# EasyEDA Pro project ProPrj_PCB_2025-05-19.epro, board 手掌0.3
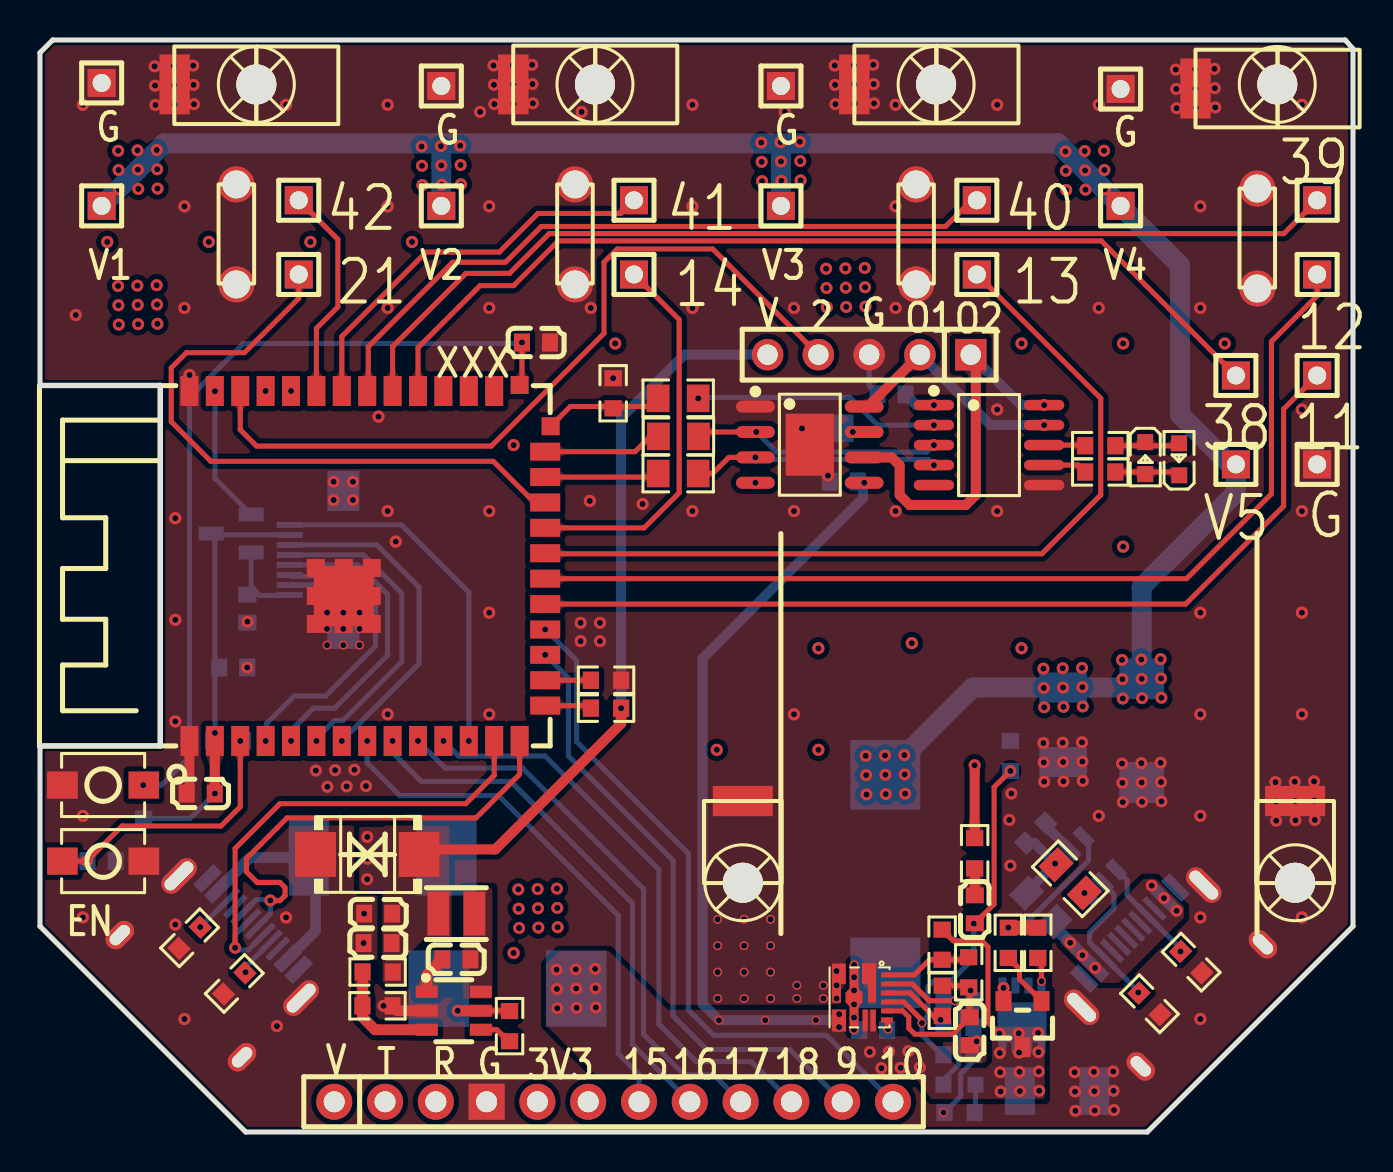
[diagram p8: board, top side]
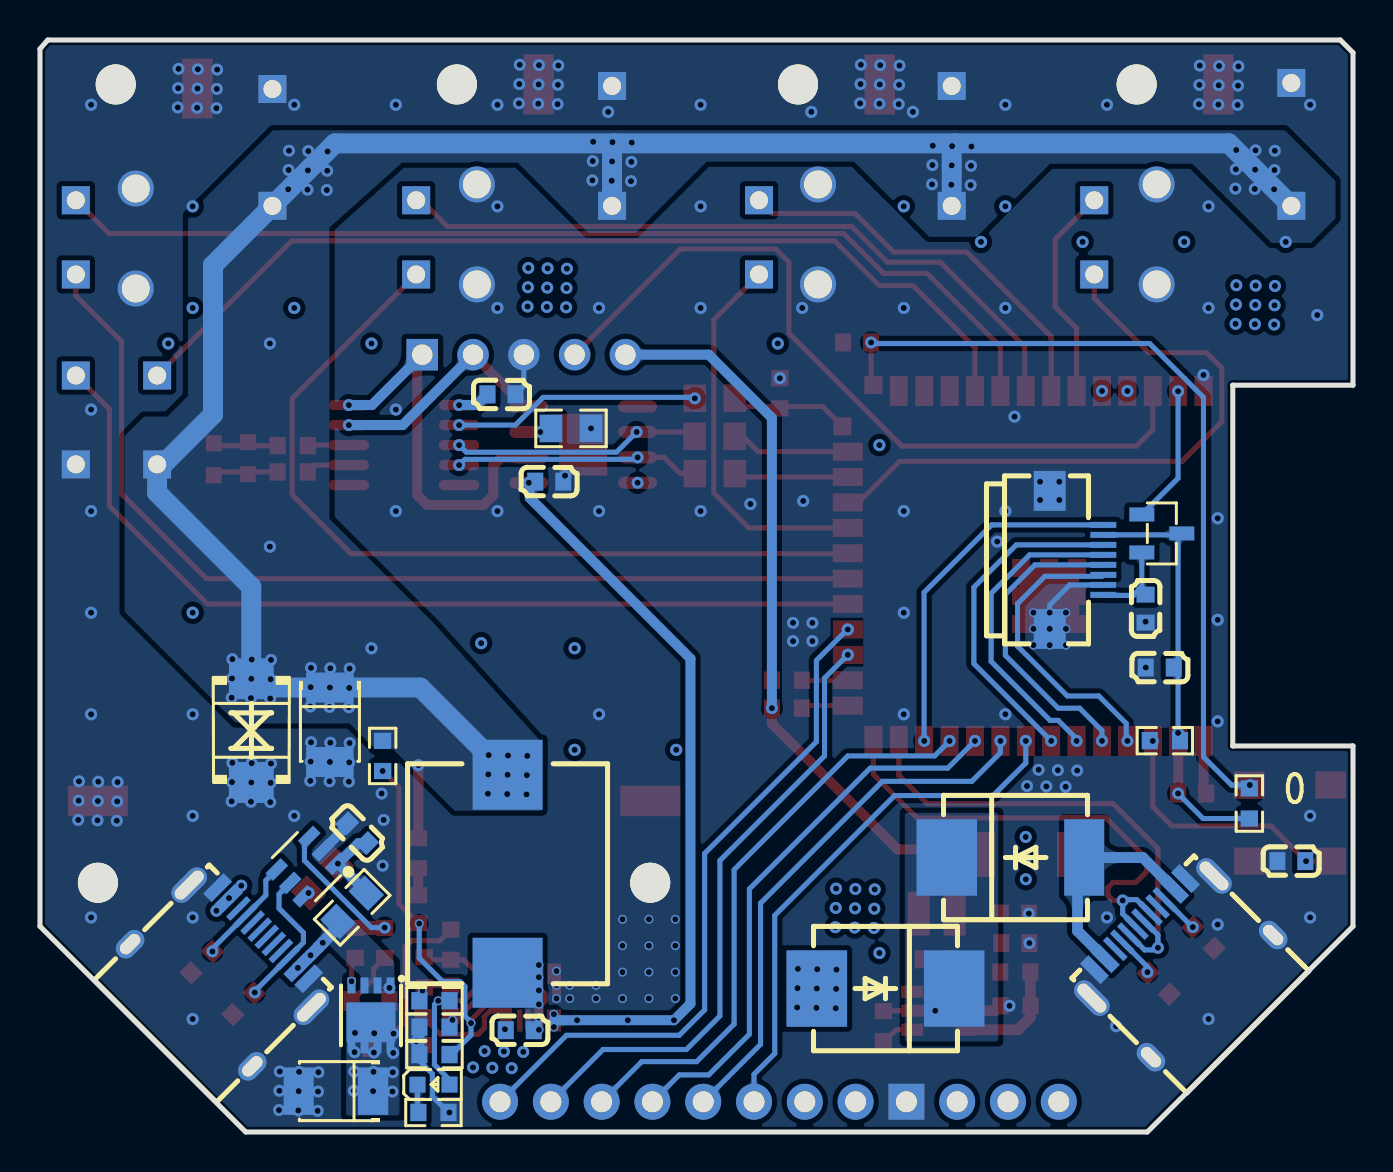
[diagram p9: board, bottom side, seen from below]

Outline 65.66 x 54.61 mm; copper layers: Top Layer, Inner1, Inner2, Bottom Layer. Coordinates in mm from the lower left corner of the outline.
Outline path: 0,53.98 0.64,54.61 65.27,54.61 65.66,54.17 65.66,10.29 55.37,0 10.29,0 0,10.29 0,19.31 6.01,19.31 6.01,37.35 0,37.35 0,53.98
Stack: Top Layer 0.035mm 外层铜厚1oz / Dielectric1 0.2104mm 7628 RC49% 8.6mil / Inner1 0.0152mm 内层铜厚 / Dielectric2 1.065mm 1.1mm H/HOZ Copper / Inner2 0.0152mm 内层铜厚 / Dielectric3 0.2104mm 7628 RC49% 8.6mil / Bottom Layer 0.035mm 外层铜厚1oz

## Design rules (mm)
template: 自定义配置
spacing copperThickness1oz (default): track to track 0.102, other pairs 0.152 to 0.3
spacing copperThickness2oz: track to track 0.203, other pairs 0.152 to 0.3
track width copperThickness1oz (default): min 0.127, default 0.254, max 2.54
track width copperThickness2oz: min 0.203, default 0.254, max 2.54
differential pair differentialPair (default): width min 0.127, default 0.254, max 2.54; gap min 0.152, default 0.152
via viaSize (default): diameter min 0.4, default 0.61, max 10; hole min 0.3, default 0.305, max 6.3

## Placement (name value [footprint] x y rotation side)
C1  100nF  [C0603]  49.79 14.95 225 bottom
C5  220pf  [C0603]  46.75 11.14 90 top
C6  100nF  [C0603]  41.67 5.09 0 bottom
C7  100nF  [C0603]  40.19 32.52 180 bottom
C9  100nF  [C0603]  8.04 16.93 0 top
C10  100nF  [C0603]  24.8 39.48 180 top
C11  100nF  [C0603]  3.08 13.55 180 bottom
C24  100nF  [C0603]  10.37 26.17 270 bottom
C25  100nF  [C0603]  9.66 23.23 0 bottom
C26  100nF  [C0603]  20.82 8.64 0 top
C27  10uF  [C0603]  16.91 10.92 180 top
C28  100nF  [C0603]  16.88 9.45 180 top
C29  10uF  [C0603]  46.49 5.04 90 top
C31  100uF  [CASE-B_3528]  51.16 20.37 270 bottom
C32  100uF  [CASE-B_3528]  50.86 2.04 0 bottom
C33  10uF  [C0603]  42.58 36.89 0 bottom
D1  SMBJ33CA  [SMB_L4.6-W3.6-LS5.4-BI]  16.37 13.88 0 top
D2  SMBJ33CA  [SMB_L4.6-W3.6-LS5.4-BI]  55.09 20.07 90 bottom
D3  S10MC  [SMC_L7.1-W6.2-LS8.1-RD#2]  23.38 7.17 0 bottom
D4  S10MC  [SMC_L7.1-W6.2-LS8.1-RD]  16.88 13.73 180 bottom
FPC1  AFC01-S08FCA-00  [FPC-SMD_P0.50-8P_FGS-XJ-H2.0]  13.83 28.61 90 bottom
H6  -  [HDR-TH_5P-P2.54-V-F]  41.46 38.87 180 top
H10  -  [HDR-TH_1P-V-M_XKB_X4611WV-01I-C28D40]  3.08 46.32 0 top
H11  -  [HDR-TH_1P-V-M_XKB_X4611WV-01I-C28D40]  3.08 52.46 0 top
H12  -  [HDR-TH_1P-V-M_XKB_X4611WV-01I-C28D40]  12.94 46.6 0 top
H13  -  [HDR-TH_1P-V-M_XKB_X4611WV-01I-C28D40]  12.94 42.89 0 top
H14  -  [HDR-TH_1P-V-M_XKB_X4611WV-01I-C28D40]  20.07 46.32 0 top
H15  -  [HDR-TH_1P-V-M_XKB_X4611WV-01I-C28D40]  20.07 52.31 0 top
H16  -  [HDR-TH_1P-V-M_XKB_X4611WV-01I-C28D40]  29.7 46.6 0 top
H17  -  [HDR-TH_1P-V-M_XKB_X4611WV-01I-C28D40]  29.7 42.89 0 top
H18  -  [HDR-TH_1P-V-M_XKB_X4611WV-01I-C28D40]  37.05 46.32 0 top
H19  -  [HDR-TH_1P-V-M_XKB_X4611WV-01I-C28D40]  37.05 52.31 0 top
H20  -  [HDR-TH_1P-V-M_XKB_X4611WV-01I-C28D40]  46.85 46.6 0 top
H21  -  [HDR-TH_1P-V-M_XKB_X4611WV-01I-C28D40]  46.85 42.89 0 top
H22  -  [HDR-TH_1P-V-M_XKB_X4611WV-01I-C28D40]  54.04 46.32 0 top
H23  -  [HDR-TH_1P-V-M_XKB_X4611WV-01I-C28D40]  54.04 52.16 0 top
H24  -  [HDR-TH_1P-V-M_XKB_X4611WV-01I-C28D40]  63.87 46.6 0 top
H25  -  [HDR-TH_1P-V-M_XKB_X4611WV-01I-C28D40]  63.87 42.89 0 top
H26  -  [HDR-TH_1P-V-M_XKB_X4611WV-01I-C28D40]  59.8 33.39 0 top
H27  -  [HDR-TH_1P-V-M_XKB_X4611WV-01I-C28D40]  63.87 33.39 0 top
H28  -  [HDR-TH_1P-V-M_XKB_X4611WV-01I-C28D40]  59.8 37.83 0 top
H29  -  [HDR-TH_1P-V-M_XKB_X4611WV-01I-C28D40]  63.87 37.83 0 top
H30  -  [HDR-TH_12P-P2.54-V-F]  28.68 1.51 0 top
L1  2.2uH  [IND-SMD_L11.0-W10.0]  42.28 12.91 270 bottom
L2  2.2uH  [IND-SMD_L2.5-W2.0-B]  20.82 10.92 180 top
LED1  -  [LED_0603]  45.93 2.38 180 bottom
LED2  -  [LED_0603]  56.96 33.69 90 top
LED3  -  [LED_0603]  55.27 33.65 270 top
NOREF  -  [Pad_e119]  26.75 47.39 270 top
NOREF#2  -  [Pad_e10]  23.66 52.39 0 top
NOREF#3  -  [Pad_e139]  62.76 16.55 270 top
NOREF#4  -  [Pad_e123]  60.87 47.18 270 top
NOREF#5  -  [Pad_e11]  40.72 52.39 0 top
NOREF#6  -  [Pad_e110]  9.82 47.39 270 top
NOREF#7  -  [Pad_e12]  57.78 52.18 0 top
NOREF#8  -  [Pad_e121]  43.81 47.39 270 top
NOREF#9  -  [Pad_e13]  35.14 16.55 270 top
NOREF#10  -  [Pad_e6]  6.73 52.39 0 top
NOREF#11  -  [Pad_e120]  26.75 42.39 270 top
NOREF#12  -  [Pad_e91]  9.82 42.39 270 top
NOREF#13  -  [Pad_e124]  60.87 42.18 270 top
NOREF#14  -  [Pad_e122]  43.81 42.39 270 top
Q1  AO3400A  [SOT-23-3_L2.9-W1.3-P1.90-LS2.4-BR]  9.56 29.93 0 bottom
Q2  AO3401A  [SOT-23_L2.9-W1.3-P1.90-LS2.4-BR]  49.13 5.4 90 top
Q3  NCE40P20Q  [DFN-8_L3.0-W3.0-P0.65-BL-4]  49.11 5.83 0 bottom
R1  68K  [R0603]  48.52 18.81 90 bottom
R2  15K  [R0603]  45.93 3.87 180 bottom
R3  1k  [R0603]  46.74 13.94 90 top
R4  50k  [R0603]  45.11 9.37 270 top
R5  10K  [R0603]  45.98 0.98 0 bottom
R6  NC  [R0603]  46.44 7.99 90 top
R7  50k  [R0603]  45.12 6.56 270 top
R8  NC  [R0603]  45.93 5.24 0 bottom
R11  0402WGF5101TCE  [R0603]  9.71 7.43 225 top
R13  0402WGF5101TCE  [R0603]  7.48 9.71 225 top
R45  10K  [R0603]  28.66 36.94 90 top
R49  10K  [R0603]  28.31 22.59 0 top
R50  10K  [R0603]  9.41 19.57 180 bottom
R51  10K  [R0603]  5.18 16.43 270 bottom
R55  47K  [R0805]  51.52 12.66 315 top
R68  10  [R0805]  31.91 32.93 180 top
R69  10  [R0805]  31.92 34.79 180 top
R70  5Ω  [R0805]  39.11 35.19 0 bottom
R71  10K  [R0603]  28.31 21.2 0 top
R77  68k  [R0603]  16.88 8 0 top
R78  15k  [R0603]  16.88 6.31 180 top
R94  1K  [R0805]  50.05 11.24 315 bottom
R95  10K  [R0603]  48.42 9.46 90 top
R96  10K  [R0603]  23.48 5.29 90 top
R97  50k  [R0603]  45.93 6.56 0 bottom
R98  10K  [R0603]  49.9 9.46 270 top
R99  0402WGF5101TCE  [R0603]  57.57 8.5 315 top
R100  0402WGF5101TCE  [R0603]  55.48 6.41 315 top
R103  10  [R0805]  31.91 36.69 0 top
R104  10K  [R0603]  53.02 34.32 0 top
R105  10K  [R0603]  53.02 33.01 0 top
SW1  -  [Key_SMD_3x4x2]  3.16 13.55 0 top
SW2  -  [Key_SMD_3x4x2]  3.16 17.35 180 top
TP1  -  [M2螺丝]  10.82 52.39 0 top
TP2  -  [M2螺丝]  27.75 52.39 0 top
TP3  -  [M2螺丝]  44.81 52.39 0 top
TP4  -  [M2螺丝]  61.87 52.39 0 top
TP7  -  [M2螺丝]  35.14 12.47 270 top
TP9  -  [M2螺丝]  62.76 12.47 0 top
U1  SY8368AQQC  [QFN-12_L3.0-W3.0-P0.45-TL-EP]  41.16 6.72 270 top
U2  ESP32-S3-WROOM-1-N16R8  [esp32s3-woom-1]  16.37 28.31 90 top
U33  A4950ELJTR-T  [SOIC-8_L4.9-W3.9-P1.27-LS6.0-BL-EP]  38.5 34.37 270 top
U40  CH221K  [SOT-23-6_L2.9-W1.6-P0.95-LS2.9-BL]  52.33 13.27 45 bottom
U41  SY8253ADC  [SOT-23-6_L2.9-W1.6-P0.95-LS2.8-BR]  20.69 6.06 180 top
U42  AT8549  [SSOP-10_L4.9-W3.9-P1.00-LS6.0-BL]  47.46 34.35 270 top
USB1  -  [USB-C-SMD_TYPEC-304-BCP16]  8.85 8.6 135 bottom
USB2  -  [USB-C-SMD_TYPEC-304-BCP16]  56.3 8.14 225 bottom

## Footprints (pads in the part's own frame, mm; a bottom-side part is the same pattern mirrored in y, then rotated)
C0603
  rect 0.8x0.9 smd: 1(-0.7,0) 2(0.7,0)
CASE-B_3528
  rect 1.506x2.376 smd: 1(-1.861,0) 2(1.861,0)
DFN-8_L3.0-W3.0-P0.65-BL-4
  rect 0.4x0.8 smd: 1(-0.975,-1.5) 2(-0.325,-1.5) 3(0.325,-1.5) 4(0.975,-1.5) 5(0.975,1.5) 6(0.326,1.5) 7(-0.325,1.5) 8(-0.975,1.5)
  rect 2.45x2 smd: 9(0,0.35)
esp32s3-woom-1
  rect 1.5x0.9 smd: 1(-8.75,8.895) 2(-8.75,7.625) 3(-8.75,6.355) 4(-8.75,5.085) 5(-8.75,3.815) 6(-8.75,2.545) 7(-8.75,1.275) 8(-8.75,0.005) 9(-8.75,-1.265) 10(-8.75,-2.535) 11(-8.75,-3.805) 12(-8.75,-5.075) 13(-8.75,-6.345) 14(-8.75,-7.615) 28(8.75,-6.345) 29(8.75,-5.075) 30(8.75,-3.805) 31(8.75,-2.535) 32(8.75,-1.265) 33(8.75,0.005) 34(8.75,1.275) 35(8.75,2.545) 36(8.75,3.815) 37(8.75,5.085) 38(8.75,6.355) 39(8.75,7.625) 40(8.75,8.895)
  rect 0.9x1.5 smd: 15(-6.985,-8.895) 16(-5.715,-8.895) 17(-4.445,-8.895) 18(-3.175,-8.895) 19(-1.905,-8.895) 20(-0.635,-8.895) 21(0.635,-8.895) 22(1.905,-8.895) 23(3.175,-8.895) 24(4.445,-8.895) 25(5.715,-8.895)
  rect 0.9x0.9 smd: 26(6.985,-9.165) 27(9.05,-7.615) 41(-2.9,2.575) 41(-2.9,1.175) 41(-2.9,-0.225) 41(-1.5,2.575) 41(-1.5,-0.225) 41(-0.1,2.575) 41(-0.1,1.175) 41(-0.1,-0.225)
  rect 3x3 smd: 41(-1.5,1.175)
FPC-SMD_P0.50-8P_FGS-XJ-H2.0
  rect 0.3x1.3 smd: 1(-1.75,-1.34) 2(-1.252,-1.339) 3(-0.75,-1.34) 4(-0.25,-1.34) 5(0.25,-1.34) 6(0.75,-1.34) 7(1.25,-1.34) 8(1.75,-1.34)
  rect 2x1.6 smd: 9(3.45,1.34) 10(-3.45,1.34)
HDR-TH_1P-V-M_XKB_X4611WV-01I-C28D40
  rect 1.4x1.4 hole 0.9: 1(0,0)
HDR-TH_5P-P2.54-V-F
  rect 1.575x1.575 hole 1.02: 1(-5.08,0)
  round 1.575 hole 1.02: 2(-2.54,0) 3(0,0) 4(2.54,0) 5(5.08,0)
HDR-TH_12P-P2.54-V-F
  round 1.8 hole 1.05: 1(-13.97,0) 2(-11.43,0) 3(-8.89,0) 5(-3.81,0) 6(-1.27,0) 7(1.27,0) 8(3.81,0) 9(6.35,0) 10(8.89,0) 11(11.43,0) 12(13.97,0)
  rect 1.8x1.8 hole 1.05: 4(-6.35,0)
IND-SMD_L2.5-W2.0-B
  rect 1.1x2.2 smd: 1(-0.9,0) 2(0.9,0)
IND-SMD_L11.0-W10.0
  rect 3.5x3.5 smd: 1(-4.95,0) 2(4.95,0)
Key_SMD_3x4x2
  rect 1.53x1.36 smd: 1(-2.035,0) 2(2.035,0)
LED_0603
  rect 0.8x0.8 smd: 1(-0.851,-0.01) 2(0.75,-0.005)
M2螺丝
  round 2 hole 2: 1(0,0)
Pad_e6
  rect 1.524x3 smd: GND(0,0)
Pad_e10
  rect 1.524x3 smd: GND(0,0)
Pad_e11
  rect 1.524x3 smd: GND(0,0)
Pad_e12
  rect 1.524x3 smd: GND(0,0)
Pad_e13
  rect 1.524x3 smd: GND(0,0)
Pad_e91
  round 1.8 hole 1.4: GND(0,0)
Pad_e110
  round 1.8 hole 1.4: GND(0,0)
Pad_e119
  round 1.8 hole 1.4: GND(0,0)
Pad_e120
  round 1.8 hole 1.4: GND(0,0)
Pad_e121
  round 1.8 hole 1.4: GND(0,0)
Pad_e122
  round 1.8 hole 1.4: GND(0,0)
Pad_e123
  round 1.8 hole 1.4: GND(0,0)
Pad_e124
  round 1.8 hole 1.4: GND(0,0)
Pad_e139
  rect 1.524x3 smd: GND(0,0)
QFN-12_L3.0-W3.0-P0.45-TL-EP
  custom 1.95x0.702 smd: 1(-0.746,0.299)
  custom 1.099x0.851 smd: 2(-0.01,-0.45)
  custom 1.95x0.688 smd: 3(-0.732,-1.208)
  rect 1.1x0.7 smd: 4(1.141,-1.198)
  rect 1.1x0.26 smd: 5(1.141,0.102) 6(1.141,0.502)
  rect 0.25x0.6 smd: 7(1.109,1.2) 8(0.659,1.2) 9(0.209,1.2) 10(-0.24,1.2) 11(-0.691,1.2) 12(-1.141,1.2)
R0603
  rect 0.806x0.864 smd: 1(-0.753,0) 2(0.753,0)
R0805
  rect 1.133x1.377 smd: 1(-1,0) 2(1,0)
SMB_L4.6-W3.6-LS5.4-BI
  rect 2.047x2.241 smd: 1(-2.591,0) 2(2.591,0)
SMC_L7.1-W6.2-LS8.1-RD
  rect 3.03x3.82 smd: 1(-3.435,0)
  rect 2x3.82 smd: 2(3.435,0)
SMC_L7.1-W6.2-LS8.1-RD#2
  rect 3.03x3.82 smd: 1(-3.435,0) 2(3.435,0)
SOIC-8_L4.9-W3.9-P1.27-LS6.0-BL-EP
  oval 0.602x1.941 smd: 1(-1.905,-2.72) 2(-0.635,-2.72) 3(0.635,-2.72) 4(1.905,-2.72) 5(1.905,2.72) 6(0.635,2.72) 7(-0.635,2.72) 8(-1.905,2.72)
  rect 3.098x2.41 smd: 9(0,0)
SOT-23-3_L2.9-W1.3-P1.90-LS2.4-BR
  rect 1.25x0.7 smd: 1(1,-0.95) 2(1,0.95) 3(-1,0)
SOT-23-6_L2.9-W1.6-P0.95-LS2.8-BR
  rect 1.1x0.6 smd: 1(1.35,-0.95) 2(1.35,0) 3(1.35,0.95) 4(-1.35,0.95) 5(-1.35,0) 6(-1.35,-0.95)
SOT-23-6_L2.9-W1.6-P0.95-LS2.9-BL
  rect 0.532x1.072 smd: 1(-0.95,-1.149) 2(0,-1.149) 3(0.95,-1.149) 4(0.95,1.149) 5(0,1.149) 6(-0.95,1.149)
SOT-23_L2.9-W1.3-P1.90-LS2.4-BR
  rect 1x0.8 smd: 1(1.15,-0.95) 2(1.15,0.95) 3(-1.15,0)
SSOP-10_L4.9-W3.9-P1.00-LS6.0-BL
  oval 0.525x2.014 smd: 1(-2,-2.756) 2(-1,-2.756) 3(0,-2.756) 4(1,-2.756) 5(2,-2.756) 6(2,2.756) 7(1,2.756) 8(0,2.756) 9(-1,2.756) 10(-2,2.756)
USB-C-SMD_TYPEC-304-BCP16
  oval 1.001x2.1 hole 0.6x1.801: 13(-4.321,1.633) 14(4.321,1.633)
  oval 1.001x1.6 hole 0.6x1.199: 15(-4.321,-2.547) 16(4.321,-2.547)
  rect 0.6x1.45 smd: A1B12(-3.226,2.547) A4B9(-2.451,2.547) B1A12(3.22,2.547) B4A9(2.451,2.547)
  rect 0.299x1.45 smd: A5(-1.249,2.547) A6(-0.249,2.547) A7(0.249,2.547) A8(1.249,2.547) B5(1.75,2.547) B6(0.75,2.547) B7(-0.75,2.547) B8(-1.75,2.547)

## Nets
As in the schematic, except:
GND: C1.1 C7.2 C9.1 C10.1 C11.1 C24.2 C25.2 C27.2 C28.2 C29.1 C31.2 C32.2 C33.1 D1.1 D2.1 FPC1.2 FPC1.9 FPC1.10 H6.3 H11.1 H15.1 H19.1 H23.1 H27.1 H30.4 NOREF.GND NOREF#2.GND NOREF#3.GND NOREF#4.GND NOREF#5.GND NOREF#6.GND NOREF#7.GND NOREF#8.GND NOREF#9.GND NOREF#10.GND NOREF#11.GND NOREF#12.GND NOREF#13.GND NOREF#14.GND R2.1 R5.1 R8.2 R11.2 R13.2 R45.2 R49.2 R70.1 R78.1 R99.2 R100.2 SW1.2 SW2.2 TP1.1 TP2.1 TP3.1 TP4.1 TP7.1 TP9.1 U1.1 U1.3 U2.1 U2.40 U2.41 U33.1 U33.9 U40.2 U41.2 U42.6 USB1.13 USB1.14 USB1.15 USB1.16 USB1.A1B12 USB1.B1A12 USB2.13 USB2.14 USB2.15 USB2.16 USB2.A1B12 USB2.B1A12

Pads without a net: U42 5; USB1 A8 B8; USB2 A6 A7 A8 B6 B7 B8

## Via types
v1: diameter 0.45, hole 0.305, Top Layer to Bottom Layer, 47 vias
v2: diameter 0.6, hole 0.305, Top Layer to Bottom Layer, 260 vias
v3: diameter 0.61, hole 0.305, Top Layer to Bottom Layer, 89 vias

## Routing (per net, layer and track width the routed paths; a pad name or vN(x,y) marks a point on that pad's centre or on a via; arc(x,y) is an arc through that point)
5V_CC1: length 2
  Bottom Layer w0.254: v2(10.28,7.99) 10.28,8.26 11.54,9.51
5V_CC2: length 2
  Bottom Layer w0.254: v2(8.01,10.25) 8.03,10.25 USB1.B5
GND: length 17.7
  Top Layer w0.5: C9.1 7.47,17.06 U2.1
  Top Layer w0.54: R78.1 17.88,6.06 U41.2
  Bottom Layer w0.254: C33.1 41.46,37.31 H6.3 ; R5.1 46.04,1.78 46.04,2.91 46.69,3.56 R2.1 ; FPC1.2 14.17,27.36 15.17,26.36 v1(15.17,25.98) v1(15.17,25.16)
  Bottom Layer w0.5: R2.1 R8.2 ; C1.1 50.29,15.32 U40.2
  vias: v1(14.35,25.98) v1(14.35,25.16) v1(14.35,24.35) v1(15.17,24.35) v1(15.98,25.98) v1(15.98,25.16) v1(15.98,24.35) v1(33.89,10.64) v1(33.89,9.32) v1(33.89,8) v1(33.89,6.68) v1(35.21,10.64) v1(35.21,9.32) v1(35.21,8) v1(35.21,6.68) v1(36.53,10.64) v1(36.53,9.32) v1(36.53,8) v1(36.53,6.68) v1(37.85,7.34) v1(37.85,6.68) v1(39.17,7.34) v1(39.17,6.68) v1(39.83,8.05) v1(39.83,7.34) v1(39.83,6.68) v1(45.18,0.98) v2(5.73,53.29) v2(5.75,52.33) v2(5.77,51.36) v2(6.7,53.31) v2(6.72,52.35) v2(6.73,51.38) v2(7.66,53.33) v2(7.68,52.37) v2(7.7,51.4) v2(10.37,25.52) v2(10.36,23.23) v2(13.79,18.08) v2(14.37,17.26) v2(14.69,32.52) v2(14.69,31.6) v2(14.76,18.1) v2(15.34,17.28) v2(15.65,32.52) v2(15.65,31.6) v2(15.72,18.12) v2(16.21,10.92) v2(16.18,9.45) v2(16.3,17.3) v2(17.18,6.31) v2(22.68,53.33) v2(22.7,52.37) v2(22.72,51.4) v2(23.64,53.35) v2(23.66,52.39) v2(23.68,51.42) v2(24.61,53.37) v2(24.63,52.41) v2(24.65,51.44) v2(27.04,25.46) v2(27.04,24.55) v2(28,25.46) v2(28,24.55) v2(38.11,35.19) v2(39.4,32.82) v2(39.74,53.33) v2(39.76,52.37) v2(39.78,51.4) v2(40.7,53.35) v2(40.72,52.39) v2(40.74,51.42) v2(41.67,53.37) v2(41.69,52.41) v2(41.71,51.44) v2(46.84,4.53) v2(48.47,15.61) v2(48.52,13.32) v2(48.58,16.93) v2(50.18,19.45) v2(50.2,18.49) v2(50.21,17.52) v2(51.14,19.47) v2(51.16,18.51) v2(51.18,17.54) v2(51.74,2.99) v2(51.76,2.02) v2(51.78,1.06) v2(52.11,19.49) v2(52.13,18.52) v2(52.14,17.56) v2(52.7,3.01) v2(52.72,2.04) v2(52.74,1.08) v2(53.67,3.03) v2(53.69,2.06) v2(53.71,1.1) v2(54.11,18.43) v2(54.13,17.46) v2(54.15,16.5) v2(55.07,18.45) v2(55.09,17.48) v2(55.11,16.52) v2(56.04,18.46) v2(56.06,17.5) v2(56.08,16.53) v2(56.8,53.13) v2(56.82,52.16) v2(56.84,51.2) v2(57.77,53.15) v2(57.78,52.18) v2(57.8,51.22) v2(58.73,53.17) v2(58.75,52.2) v2(58.77,51.24) v2(61.78,17.5) v2(61.8,16.53) v2(61.82,15.57) v2(62.75,17.52) v2(62.76,16.55) v2(62.78,15.59) v2(63.71,17.54) v2(63.73,16.57) v2(63.75,15.61) v3(1.79,40.85) v3(2.14,51.37) v3(2.14,15.81) v3(2.14,10.73) v3(6.77,30.69) v3(6.77,25.61) v3(6.77,20.53) v3(6.77,10.37) v3(7.22,46.29) v3(7.22,41.21) v3(7.22,5.65) v3(7.48,37.86) v3(11.85,5.29) v3(12.3,51.37) v3(12.3,10.73) v3(16.93,35.77) v3(17.38,51.37) v3(17.38,46.29) v3(17.38,41.21) v3(17.38,31.05) v3(17.38,20.89) v3(17.79,29.53) v3(22.01,51.01) v3(22.46,46.29) v3(22.46,41.21) v3(22.46,31.05) v3(22.46,25.97) v3(22.46,20.89) v3(27.09,51.01) v3(27.54,41.21) v3(27.49,31.56) v3(28.66,37.7) v3(30.14,31.41) v3(32.62,51.37) v3(32.62,46.29) v3(32.62,41.21) v3(32.62,31.05) v3(37.25,51.01) v3(37.7,41.21) v3(37.7,31.05) v3(37.7,20.89) v3(42.78,51.37) v3(42.78,46.29) v3(42.78,41.21) v3(42.78,31.05) v3(47.86,51.37) v3(47.86,36.13) v3(47.86,31.05) v3(52.94,51.37) v3(52.94,41.21) v3(52.94,15.81) v3(58.02,46.29) v3(58.02,41.21) v3(58.02,25.97) v3(58.02,20.89) v3(58.02,15.81) v3(58.02,10.73) v3(58.02,5.65) v3(63.1,51.37) v3(63.1,36.13) v3(63.1,31.05) v3(63.1,25.97) v3(63.1,20.89) v3(63.1,10.73)
VBUS: length 3.2
  Bottom Layer w0.6: v2(52.76,8.21) v2(52.13,8.84) 51.73,9.25 51.73,9.26 50.76,10.23 R94.2
  vias: v2(48.18,7.21) v2(51.52,9.46) v2(55.59,12.32) v2(56.21,11.7) v2(56.84,11.06)
VCC: length 69.9
  Top Layer w0.5: U2.2 8.74,16.93 v2(8.75,16.93) ; D1.2 19.21,14.13 22.77,14.13 29.06,20.42 v2(29.06,21.2)
  Inner2 w0.5: H30.1 14.71,12.23 15.13,12.64 v2(16.36,12.64)
  Bottom Layer w0.254: v2(8.75,19.96) 8.75,29.75 8.63,29.86 ; FPC1.7 8.63,29.86 ; 8.63,29.86 Q1.3 ; v2(8.75,16.93) 7.5,15.68 R51.2
  Bottom Layer w0.5: H6.5 32.22,38.87 29.06,35.72 v2(29.06,21.2)
  vias: v2(16.37,14.76) v2(16.38,13.67)
VIN: length 2.6
  Top Layer w0.254: U41.5 23.46,6.06 R96.2
  Top Layer w0.54: U41.5 v2(20.89,6.06)
VIN_5V: length 11
  Bottom Layer w0.54: USB1.A4B9 13.78,10.06 13.78,13.39 13.44,13.73 10.51,13.73 USB1.B4A9
VIN_PD: length 44.4
  Top Layer w0.254: R4.1 45.67,9.56 47.1,9.56 47.41,9.26 47.41,5.49 v2(47.98,4.92)
  Bottom Layer w0.254: v1(39.96,5.25) v1(39.96,5.89)
  Bottom Layer w0.5: 39.96,5.59 v1(38.8,5.59) v1(36.26,5.59) v1(33.95,5.59) 33.13,6.41 33.13,23.68 41.17,31.71 41.17,32.42 v2(41.22,32.47)
  vias: v2(25.83,8.12) v2(25.85,7.16) v2(25.87,6.19) v2(26.79,8.14) v2(26.81,7.17) v2(26.83,6.21) v2(27.76,8.16) v2(27.78,7.19) v2(27.8,6.23) v2(41.5,4.01) v2(42.07,3.19) v2(42.46,4.02) v2(43.04,3.21) v2(43.43,4.04) v2(44,3.23) v2(48,3.95) v2(48.02,2.99) v2(48.04,2.02) v2(48.94,4.94) v2(48.96,3.97) v2(48.98,3.01) v2(49,2.04) v2(49.91,4.96) v2(49.93,3.99) v2(49.95,3.03) v2(49.97,2.06)
A4950_IN1: length 12.3
  Top Layer w0.254: v2(35.78,33.74) 34.45,33.74 33.64,32.93 R68.1
  Bottom Layer w0.254: v2(35.78,33.74) 35.87,33.64 44.41,33.64 v2(44.7,33.35)
A4950_IN2: length 12.4
  Top Layer w0.254: R69.1 33.14,35.01 v2(35.82,35.01)
  Bottom Layer w0.254: v2(35.82,35.01) 36.83,34 44.35,34 v2(44.7,34.35)
CC1: length 5.4
  Bottom Layer w0.254: v2(57.03,9.03) 57.03,9.17 USB2.A5 54.37,11.84 54.37,12.58 53.82,13.13
CC2: length 7.3
  Bottom Layer w0.254: 53.15,12.46 53.71,11.9 53.71,11.19 52.49,9.97 52.49,9.47 USB2.B5 54.98,6.98 54.98,6.97
  vias: v2(54.92,6.98)
CHIP_PU: length 13.3
  Top Layer w0.254: v2(10.01,19.56) 10.01,16.26 9.05,15.3 4.1,15.3 v2(2.35,13.55) SW1.1
D+: length 24.6
  Top Layer w0.254: U2.14 23.98,17.89 21.8,15.71 12.36,15.71 10.32,13.68 10.32,13.02 10.86,12.48 12,12.48 12.25,12.23 12.25,11.82 12,11.57 11.53,11.57 v2(11.52,11.58)
  Bottom Layer w0.254: 10.83,10.22 11.52,10.91 v2(11.52,11.58) 11.48,11.62 10.81,11.62 10.12,10.93
D-: length 24.6
  Top Layer w0.254: U2.13 22.71,17.84 21.3,16.42 12,16.42 9.76,14.18 v2(9.76,9.21)
  Bottom Layer w0.254: USB1.B7 10.42,9.1 9.87,9.1 v2(9.76,9.21) 9.76,9.86 10.48,10.57
EN: length 4.4
  Top Layer w0.254: U1.12 43.72,7.86 44.48,8.61 R4.2 46.32,8.61 R6.2
FB_0.6V: length 19.2
  Top Layer w0.254: 42.36,6.51 43.19,6.51 44.05,5.65 44.05,5.5 v1(44.11,5.45) ; C5.1 47.71,11.4 47.71,17.24 v2(48.52,18.05)
  Bottom Layer w0.254: v1(46.7,10.43) 46.7,8.7 45.53,7.53 44.66,7.53 44.41,7.28 44.41,5.8 44.11,5.5 v1(44.11,5.45) 44.11,4.85 45.08,3.87
GPIO0: length 40.7
  Top Layer w0.254: U2.27 24.1,37.47 v2(24.1,39.48)
  Bottom Layer w0.254: v2(5.16,17.35) 6.07,17.35 7.48,18.76 7.48,36.74 10.17,39.43 24.04,39.43
GPIO1: length 6.9
  Bottom Layer w0.254: v3(8.75,37.04) 8.75,32.7 Q1.1
GPIO2: length 39.5
  Top Layer w0.254: U2.38 10.01,35.12 10.83,34.3 22.57,34.3 28.2,39.94 28.2,43.5 28.86,44.16 33.64,44.16 H6.4
GPIO3: length 2.3
  Top Layer w0.254: R71.1 27.43,21.32 U2.15
GPIO4: length 15
  Bottom Layer w0.254: FPC1.3 12.56,27.79 15.41,27.79 16.77,26.43 16.77,24.29 14.29,21.8 12.71,21.8 11.34,20.43 11.34,19.52
  vias: v2(11.28,19.56)
GPIO5: length 15.4
  Bottom Layer w0.254: FPC1.4 15.91,28.36 17.38,26.88 17.38,23.84 14.74,21.2 13.68,21.2 12.56,20.08 12.56,19.57
  vias: v2(12.55,19.56)
GPIO6: length 15.7
  Bottom Layer w0.254: FPC1.5 16.17,28.86 18.1,26.94 18.1,23.53 15.15,20.59 14.74,20.59 13.78,19.62
  vias: v2(13.82,19.56)
GPIO7: length 16.6
  Bottom Layer w0.254: FPC1.6 16.84,29.36 18.96,27.24 18.96,23.42 v2(15.09,19.56)
GPIO8: length 17.8
  Bottom Layer w0.254: v2(21.44,19.56) 21.45,19.56 21.45,26.99 18.07,30.36 FPC1.8
GPIO9: length 30.9
  Bottom Layer w0.254: v3(25.26,23.86) 26.43,22.7 26.43,18.81 31.66,13.58 31.66,5.8 33.34,4.13 37.5,4.13 H30.11
GPIO10: length 34.1
  Bottom Layer w0.254: v3(25.26,25.13) 25.28,25.13 26.83,23.58 26.83,19.52 32.42,13.93 32.42,6.11 33.69,4.84 39.33,4.84 H30.12
GPIO11: length 46.2
  Top Layer w0.254: U2.19 57.29,26.4 62.19,31.3 62.19,36.16 H29.1
GPIO12: length 50
  Top Layer w0.254: U2.20 57.34,27.67 61.58,31.91 61.58,39.53 63.87,41.82 H25.1
GPIO13: length 42.6
  Top Layer w0.254: U2.21 25.29,28.92 50.1,28.92 53.05,31.86 53.05,36.69 H21.1
GPIO14: length 19.3
  Top Layer w0.254: H17.1 31.96,40.62 31.96,31.96 30.21,30.21 U2.22
GPIO15: length 26.6
  Bottom Layer w0.254: v3(16.36,19.56) 16.36,18.46 17.99,16.83 22.92,16.83 28.92,10.83 28.92,3.92 29.95,2.88 H30.7
GPIO16: length 26.8
  Bottom Layer w0.254: v3(17.63,19.56) 17.63,18.96 19.06,17.54 23.53,17.54 29.63,11.44 29.63,4.38 H30.8
GPIO17: length 27.9
  Bottom Layer w0.254: v3(18.9,19.56) 20.26,18.2 24.14,18.2 30.19,12.15 30.19,4.89 32.22,2.86 33.69,2.86 H30.9
GPIO18: length 29.4
  Bottom Layer w0.254: v3(20.17,19.56) 20.92,18.81 25.26,18.81 30.95,13.12 30.95,5.4 32.83,3.52 35.57,3.52 H30.10
GPIO21: length 32.1
  Top Layer w0.254: H13.1 12.94,41.69 10.22,38.98 7.33,38.98 6.56,38.21 6.56,35.52 8.55,33.54 22.67,33.54 24.72,31.48 U2.23
GPIO38: length 48.1
  Top Layer w0.254: U2.31 18.9,39.22 22.01,42.33 23.68,42.33 25.92,44.56 53.07,44.56 H28.1
GPIO39: length 51.5
  Top Layer w0.254: U2.32 17.63,39.27 21.3,42.94 23.48,42.94 25.47,44.93 62.2,44.93 H24.1
GPIO40: length 35.7
  Top Layer w0.254: H20.1 46.59,46.6 45.29,45.29 25.07,45.29 23.28,43.5 20.64,43.5 16.41,39.27 16.41,37.11 U2.33
GPIO41: length 20.2
  Top Layer w0.254: U2.34 15.09,39.78 19.31,44 22.97,44 24.9,45.93 29.04,45.93 H16.1
GPIO42: length 10.8
  Top Layer w0.254: U2.35 13.82,40.19 14.9,41.26 14.9,44.64 H12.1
GPIO45: length 6
  Top Layer w0.254: U2.26 26.52,36.28 30.51,36.28 R103.1
GPIO46: length 2.3
  Top Layer w0.254: U2.16 R49.1
GPIO47: length 5.7
  Top Layer w0.254: U2.24 30.63,32.75 30.81,32.93 R68.2
GPIO48: length 6
  Top Layer w0.254: U2.25 29.75,34.02 30.52,34.79 R69.2
ILMT: length 3.2
  Top Layer w0.254: U1.10 43.51,6.96 44.86,5.61 v1(45.03,5.61)
LX: length 2.6
  Top Layer w0.4: v1(40.71,6.38) 40.69,6.36
  Top Layer w0.45: 40.71,7.08 40.71,7.74 ; v1(40.71,6.38) 40.71,5.12 v1(40.71,5.11) ; v1(40.71,8.35) v1(40.71,7.74)
  vias: v1(40.71,7.08) v1(40.71,5.72)
OUT1: length 19.5
  Top Layer w0.5: H6.1 46.8,38.62 46.8,31.86 46.3,31.36 43.49,31.36 42.99,31.86 42.99,33.34 42.59,33.74 U33.6
  Bottom Layer w0.5: v2(50.21,36.35) 49.06,36.35 H6.1
OUT2: length 11.5
  Top Layer w0.5: H6.2 41.41,36.28 U33.8
  Bottom Layer w0.5: v2(50.21,35.35) 47.52,35.35 H6.2
PG: length 8.2
  Top Layer w0.7: R95.2 R98.1
  Bottom Layer w0.254: v2(48.42,10.22) 49.08,10.22 52.44,13.58 52.44,14.51 U40.3
SY8368_PG: length 9
  Top Layer w0.254: 42.36,7.41 43.62,7.41 44.46,6.56 v1(45.74,6.56)
  Bottom Layer w0.254: 45.08,6.56 45.74,6.56 v1(45.74,6.56) 45.93,6.37 45.93,3.36 45.03,2.46 45.03,2.37
SY8368_VCC: length 8.2
  Top Layer w0.254: R7.1 46.36,7.32 R6.1 46.49,7.18 C29.2 45.64,4.89 43.75,4.89 43.44,5.19 43.44,5.75 43.14,6.06 U1.8
  vias: v1(46.53,7.07)
U0RXD: length 38.5
  Inner1 w0.254: v3(12.55,37.06) 13.17,36.44 13.17,12.15 15.45,9.87 15.45,5.9 19.79,1.56 H30.3
U0TXD: length 38
  Inner1 w0.254: v3(11.28,37.06) 11.9,36.44 11.9,12.46 14.79,9.56 14.79,5.55 17.25,3.09 H30.2
VOUT3V3: length 108.2
  Top Layer w0.254: v2(46.74,18.34) 46.75,18.35
  Top Layer w0.5: R3.2 v2(46.74,18.34)
  Bottom Layer w0.5: v2(44.7,36.35) 43.82,36.35 C33.2
  Bottom Layer w1: H18.1 v2(37.05,48.54) 37.05,49.33 36.94,49.44 ; H10.1 v2(4.89,48.13) 6.21,49.44 19.91,49.44 ; v2(42.28,17.86) 46.64,22.23 v2(51.16,22.23) 54.66,22.23 v2(55.09,22.66) 55.09,27.26 59.8,31.97 H26.1 59.5,33.39 57.01,35.88 57.01,43.34 H22.1 v2(52.26,48.09) 50.91,49.44 36.94,49.44 ; 19.91,49.44 20.07,49.28 v2(20.07,48.34) H14.1 ; 19.91,49.44 36.94,49.44
  vias: v2(3.91,49.07) v2(3.93,48.11) v2(3.9,42.31) v2(3.92,41.34) v2(3.94,40.38) v2(3.95,47.14) v2(4.88,49.09) v2(4.91,47.16) v2(4.87,42.33) v2(4.89,41.36) v2(4.91,40.4) v2(5.84,49.11) v2(5.83,42.35) v2(5.86,48.14) v2(5.88,47.18) v2(5.85,41.38) v2(5.87,40.42) v2(19.08,49.28) v2(19.1,48.32) v2(19.12,47.35) v2(20.05,49.3) v2(20.09,47.37) v2(21.01,49.32) v2(21.03,48.36) v2(21.05,47.39) v2(23.92,12.13) v2(23.94,11.17) v2(23.96,10.2) v2(24.88,12.15) v2(24.9,11.19) v2(24.92,10.22) v2(25.85,12.17) v2(25.87,11.21) v2(25.89,10.24) v2(35.78,32.47) v2(36.07,49.48) v2(36.09,48.52) v2(36.11,47.55) v2(37.03,49.5) v2(37.07,47.57) v2(38,49.52) v2(38.02,48.55) v2(38.04,47.59) v2(39.31,43.17) v2(39.33,42.21) v2(39.35,41.24) v2(40.28,43.19) v2(40.3,42.23) v2(40.31,41.26) v2(41.24,43.21) v2(41.26,42.25) v2(41.28,41.28) v2(41.29,18.81) v2(41.31,17.85) v2(41.33,16.88) v2(42.26,18.83) v2(42.3,16.9) v2(43.22,18.85) v2(43.24,17.88) v2(43.26,16.92) v2(50.18,23.17) v2(50.2,22.21) v2(50.21,21.24) v2(51.14,23.19) v2(51.18,21.26) v2(51.28,49.04) v2(51.3,48.07) v2(51.32,47.11) v2(52.11,23.21) v2(52.13,22.25) v2(52.14,21.28) v2(52.24,49.06) v2(52.28,47.12) v2(53.21,49.07) v2(53.23,48.11) v2(53.25,47.14) v2(54.11,23.61) v2(54.13,22.64) v2(54.15,21.68) v2(55.07,23.63) v2(55.11,21.7) v2(56.04,23.65) v2(56.06,22.68) v2(56.08,21.72) v3(3.36,44.51) v3(8.44,44.51) v3(13.52,44.51) v3(18.6,44.51) v3(23.68,34.35) v3(23.68,8.95) v3(28.76,39.43) v3(33.84,19.11) v3(38.92,24.19) v3(38.92,19.11) v3(43.6,24.45) v3(49.08,39.43) v3(49.08,24.19) v3(54.16,39.43) v3(54.16,29.27) v3(59.24,39.43)
$1N4191: length 4
  Bottom Layer w0.5: C1.2 49.73,14.45 v2(50.76,13.42) 49.34,12 R94.1
$1N4196:
  vias: v2(52.23,11.95)
$1N5339:
  vias: v2(40.65,35.01)
$1N6297: length 3.8
  Bottom Layer w0.254: Q1.2 10.56,27.26 10.98,26.83 12.46,26.83 FPC1.1
$1N11366: length 1.9
  Top Layer w0.54: 20.12,8.64 19.34,7.86 U41.1
$1N11492: length 5.7
  Top Layer w0.54: U41.3 16.75,5.12 16.13,5.73 16.13,8
$1N14990: length 2.8
  Top Layer w0.254: R95.1 48.98,8.15 48.98,7.65 Q2.1
$1N15210: length 1.6
  Top Layer w0.254: 23.48,4.74 23.22,4.74 22.85,5.12 U41.4
$1N15667: length 1.3
  Top Layer w0.5: C5.2 46.75,13.18
$1N15674: length 0.5
  Top Layer w0.254: U1.7 42.41,5.56 v1(42.41,5.14)
$1N15711: length 1.4
  Bottom Layer w0.254: LED1.1 46.78,1.02 R5.2
$1N16104: length 1.2
  Top Layer w0.254: R98.2 50.08,8.52 v1(50.08,7.54)
$1N18690: length 2.1
  Top Layer w0.254: U42.8 52.24,34.35 R104.1
$1N18692: length 2.2
  Top Layer w0.254: U42.7 51.92,33.35 R105.1
$1N18776: length 3.2
  Top Layer w0.254: R104.2 56.84,34.32 LED2.2
$1N18803: length 3.3
  Top Layer w0.254: LED2.1 56.8,33.01 R105.2
$1N18934: length 12.4
  Bottom Layer w0.254: v2(44.7,35.35) 41.89,35.35 40.5,36.74 32.96,36.74 v2(32.91,36.69)

## Copper pours and planes (outline as drawn; the poured copper is in the pictures)
GND on Top Layer: -2.12,56.35 69.66,56.35 69.66,-1.06 -2.12,-1.06
GND on Top Layer: 41.11,8.28 41.11,8.55 40.9,8.75 40.5,8.75 40.35,8.6 40.35,7.94 40.19,7.78 40.1,7.78 39.63,8.24 39.63,8.8 40.09,9.26 41.26,9.26 41.82,8.7 41.82,8.04 41.35,8.04
GND on Bottom Layer: 37.28,18.41 47.28,18.41 47.28,7.41 37.28,7.41
GND on Bottom Layer: -2.83,58.23 71.79,58.23 71.79,-5.73 -2.83,-5.73
GND on Inner1: -1.61,58.43 70.06,58.43 70.06,-3.04 -1.61,-3.04
GND on Inner2: -3.7,57.16 70.57,57.16 70.57,-4.92 -3.7,-4.92
VBUS on Top Layer: 51.29,9.9 52.43,9.9 55.19,12.66 55.81,12.66 57.21,11.25 57.21,10.73 53.94,7.46 53.02,7.46 51.06,9.41 51.06,9.67
VBUS on Bottom Layer: 47.93,6.93 49.5,6.93 49.6,7.03 49.6,7.76 51.57,9.73 51.57,10.48 50.96,11.09 50.5,11.09 47.92,8.5 47.92,7.67 47.93,7.65
VBUS on Inner1: 51.29,9.9 52.43,9.9 55.19,12.66 55.81,12.66 57.21,11.25 57.21,10.73 53.94,7.46 53.02,7.46 51.06,9.41 51.06,9.67
VBUS on Inner2: 51.29,9.9 52.43,9.9 55.19,12.66 55.81,12.66 57.21,11.25 57.21,10.73 53.94,7.46 53.02,7.46 51.06,9.41 51.06,9.67
VCC on Top Layer: 17.18,15.35 20.48,15.35 20.48,9.78 17.18,9.78
VCC on Top Layer: 17.44,12.25 20.48,12.25 20.58,12.15 20.58,9.73 20.48,9.63 19.18,9.63 18.27,8.72 18.27,7.34 17.31,7.34 17.13,7.52 17.13,11.95
VCC on Top Layer: 15.96,15.26 18.24,15.26 18.24,12.08 15.96,12.08
VCC on Inner2: 8.09,20.55 8.09,16.42 12.36,12.15 16.88,12.15 16.88,15.3 11.59,15.3 9.32,17.57 9.32,20.55
VIN on Bottom Layer: 17.74,15.96 22.41,15.96 22.41,4.53 17.74,4.53
VIN_PD on Top Layer: 47.61,5.25 47.61,3.5 47.32,3.21 45.93,3.21 44.5,4.63 43.56,4.63 43.4,4.79 42.07,4.79 41.87,4.99 41.87,6.01 41.77,6.11 41.05,6.11 41.05,5.05 41.06,5.04 40.42,5.04 40.35,5.12 40.35,6.06 40.3,6.11 31.41,6.11 28.46,9.05 25.97,9.05 25.31,8.39 25.31,5.35 27.89,2.76 43.72,2.76 44.59,1.65 50.24,1.65 50.24,5.16 50.12,5.27 47.63,5.27
VIN_PD on Bottom Layer: 47.68,6.46 50.35,6.46 50.35,0.82 47.68,0.82
VIN_PD on Inner1: 47.4,5.05 47.4,4.21 47.22,4.02 46.54,4.02 45.77,4.79 42.07,4.79 41.87,4.99 41.87,5.05 41.05,5.05 41.06,5.04 40.42,5.04 40.35,5.12 40.35,6.06 40.3,6.11 31.41,6.11 28.46,9.05 25.97,9.05 25.31,8.39 25.31,5.6 28.15,2.76 43.72,2.76 44.59,1.65 45.76,1.65 45.78,1.61 50.24,1.61 50.24,5.16 50.12,5.27 47.63,5.27
VIN_PD on Inner2: 47.4,5.05 47.4,4.21 47.22,4.02 46.54,4.02 45.77,4.79 42.07,4.79 41.87,4.99 41.87,5.05 41.05,5.05 41.06,5.04 40.42,5.04 40.35,5.12 40.35,6.06 40.3,6.11 31.41,6.11 28.46,9.05 25.97,9.05 25.31,8.39 25.31,5.45 28,2.76 43.72,2.76 44.59,1.65 45.76,1.65 45.78,1.61 50.24,1.61 50.24,5.16 50.12,5.27 47.63,5.27
LX on Bottom Layer: 40.52,6.73 40.52,5.17 40.55,5.14 41.41,5.14 41.41,6.74
VOUT3V3 on Bottom Layer: 53.66,20.48 51.18,24.51 51.18,45.23 47.56,48.47 41.77,48.47 38.26,44.97 35.88,44.97 32.32,48.53 24.95,48.53 21.19,44.77 18.81,44.77 15.15,48.42 8.04,48.42 4.07,44.46 2.09,44.46 0.87,45.68 0.87,47.56 3.41,50.1 54,50.1 58.26,45.85 58.26,36.81 59.29,35.77 60.46,35.77 61.43,34.81 61.43,26.02 55.89,20.48
VOUT3V3 on Bottom Layer: 45.88,25.36 52.79,32.27 52.79,25.63 50.05,22.87 48.37,22.87
VOUT3V3 on Bottom Layer: 40.54,19.46 40.54,16.06 44.93,16.06 48.1,19.23 48.98,19.23 50.18,20.43 55.44,20.43 56.86,21.44 56.86,23.68 54.93,25.61 46.12,25.61
VOUT3V3 on Inner1: 32.17,16.01 25.16,8.7 25.16,5.24 28.41,1.99 28.41,1.03 27.8,0.42 24.2,0.42 23.79,1.08 23.79,2.31 21.6,3.78 21.6,33.28 14.68,39.64 4.02,39.64 0.87,42.79 0.87,47.56 3.41,50.1 54,50.1 61.43,42.68 61.43,25.97 56.6,20.89 49.74,20.89 45.28,16.01
VOUT3V3 on Inner2: 24.2,0.42 23.79,1.08 23.79,2.31 21.6,3.78 21.6,10.46 31.02,19.87 43.8,19.87 44.56,19.11 44.56,16.12 44.31,15.86 40.75,15.86 40.7,15.91 32.37,15.91 25.16,8.7 25.16,5.24 28.41,1.99 28.41,1.03 27.8,0.42
$1N11371 on Top Layer: 21.16,12.22 22.62,12.22 22.62,6.67 21.16,6.67

Small or netless copper shapes (teardrops, artwork), in the pictures only: 121 on Top Layer, 114 on Bottom Layer, 4 on Inner1, 2 on Inner2

## Text on the board
Bottom Silkscreen Layer: 0
Top Silkscreen Layer: EN | V1 | G | V | T | V2 | R | X | 3V3 | 15 | 16 | 17 | V3 | 18 | 2 | 9 | 10 | O1 | O2 | V4 | 42 | 21 | 41 | 14 | 40 | 13 | 38 | V5 | 39 | 11 | 12
